# EAGLE design remote-switch (EAGLE 7.5.0)
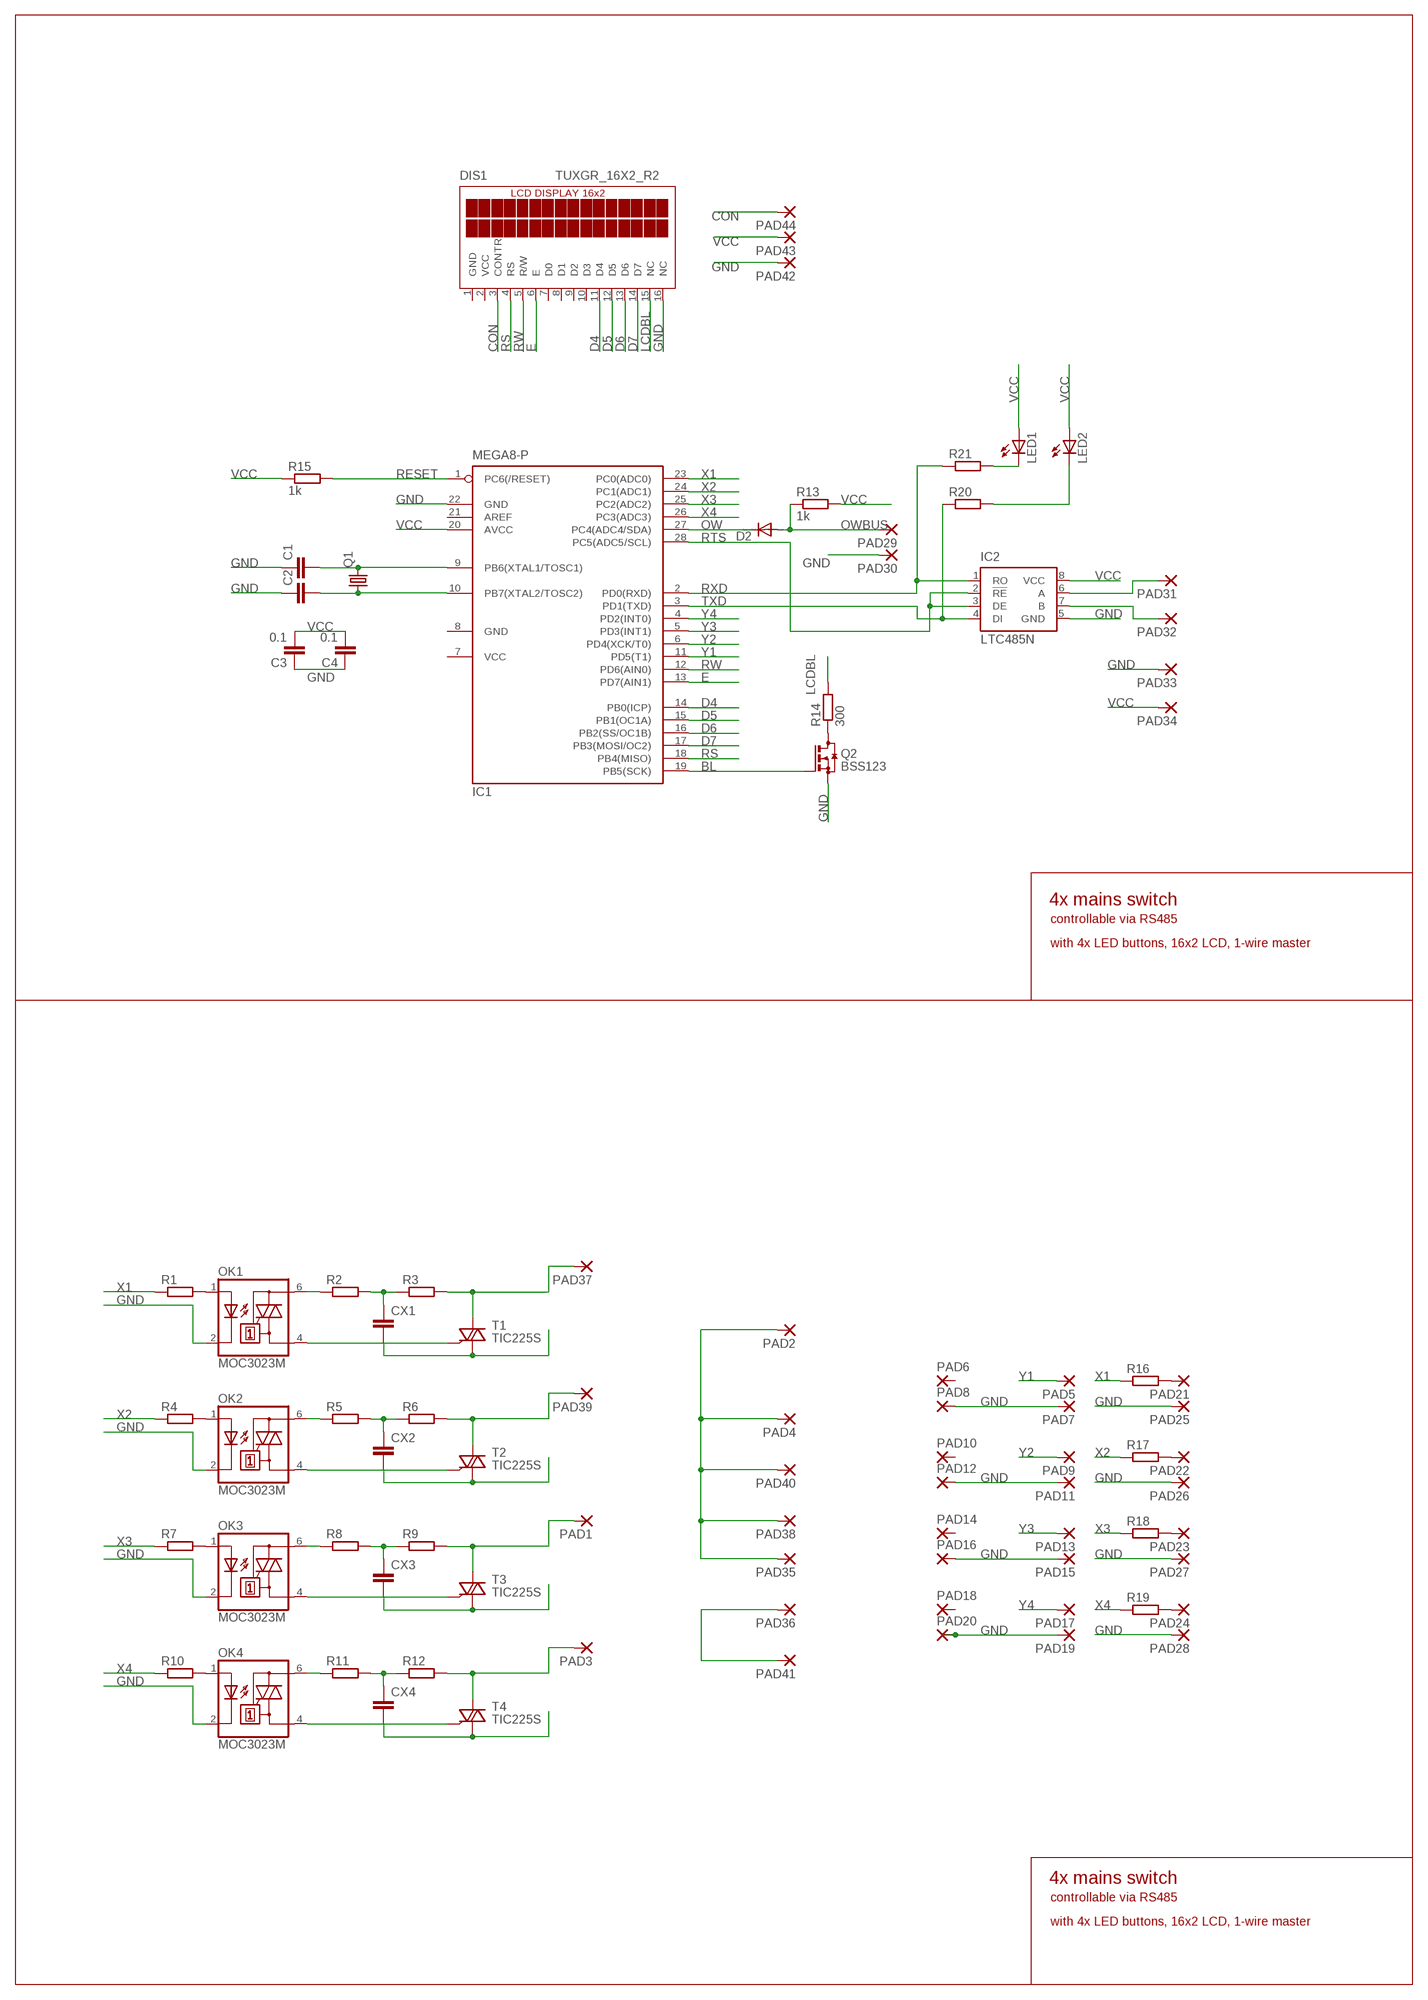
[diagram p0: schematic, sheet 1]

## Parts
C1  C-EUC0805  [C0805]
C2  C-EUC0805  [C0805]
C3  0.1  C-EUC0805  [C0805]
C4  0.1  C-EUC0805  [C0805]
CX1  CXXC15B5  [XC15B5]
CX2  CXXC15B5  [XC15B5]
CX3  CXXC15B5  [XC15B5]
CX4  CXXC15B5  [XC15B5]
D2  DIODE-MINIMELF  [MINIMELF]
DIS1  TUXGR_16X2_R2  [TUXGR_16X2_R2]
IC1  MEGA8-P  [DIL28-3]
IC2  LTC485N  [DIL08]
LED1  LEDSML0805  [SML0805]
LED2  LEDSML0805  [SML0805]
OK1  MOC3023M  [DIL06]
OK2  MOC3023M  [DIL06]
OK3  MOC3023M  [DIL06]
OK4  MOC3023M  [DIL06]
PAD1  2,54/0,8  [2,54/0,8]
PAD2  2,54/0,8  [2,54/0,8]
PAD3  2,54/0,8  [2,54/0,8]
PAD4  2,54/0,8  [2,54/0,8]
PAD5  1,6/0,8  [1,6/0,8]
PAD6  1,6/0,8  [1,6/0,8]
PAD7  1,6/0,8  [1,6/0,8]
PAD8  1,6/0,8  [1,6/0,8]
PAD9  1,6/0,8  [1,6/0,8]
PAD10  1,6/0,8  [1,6/0,8]
PAD11  1,6/0,8  [1,6/0,8]
PAD12  1,6/0,8  [1,6/0,8]
PAD13  1,6/0,8  [1,6/0,8]
PAD14  1,6/0,8  [1,6/0,8]
PAD15  1,6/0,8  [1,6/0,8]
PAD16  1,6/0,8  [1,6/0,8]
PAD17  1,6/0,8  [1,6/0,8]
PAD18  1,6/0,8  [1,6/0,8]
PAD19  1,6/0,8  [1,6/0,8]
PAD20  1,6/0,8  [1,6/0,8]
PAD21  1,6/0,8  [1,6/0,8]
PAD22  1,6/0,8  [1,6/0,8]
PAD23  1,6/0,8  [1,6/0,8]
PAD24  1,6/0,8  [1,6/0,8]
PAD25  1,6/0,8  [1,6/0,8]
PAD26  1,6/0,8  [1,6/0,8]
PAD27  1,6/0,8  [1,6/0,8]
PAD28  1,6/0,8  [1,6/0,8]
PAD29  2,54/0,8  [2,54/0,8]
PAD30  2,54/0,8  [2,54/0,8]
PAD31  2,54/0,8  [2,54/0,8]
PAD32  2,54/0,8  [2,54/0,8]
PAD33  2,54/0,8  [2,54/0,8]
PAD34  2,54/0,8  [2,54/0,8]
PAD35  2,54/0,8  [2,54/0,8]
PAD36  2,54/0,8  [2,54/0,8]
PAD37  2,54/0,8  [2,54/0,8]
PAD38  2,54/0,8  [2,54/0,8]
PAD39  2,54/0,8  [2,54/0,8]
PAD40  2,54/0,8  [2,54/0,8]
PAD41  2,54/0,8  [2,54/0,8]
PAD42  1,6/0,8  [1,6/0,8]
PAD43  1,6/0,8  [1,6/0,8]
PAD44  1,6/0,8  [1,6/0,8]
Q1  CRYSTALHC49S  [HC49/S]
Q2  BSS123  [SOT23]
R1  R-EU_M0805  [M0805]
R2  R-EU_R1206  [R1206]
R3  R-EU_R1206  [R1206]
R4  R-EU_M0805  [M0805]
R5  R-EU_R1206  [R1206]
R6  R-EU_R1206  [R1206]
R7  R-EU_M0805  [M0805]
R8  R-EU_R1206  [R1206]
R9  R-EU_R1206  [R1206]
R10  R-EU_M0805  [M0805]
R11  R-EU_R1206  [R1206]
R12  R-EU_R1206  [R1206]
R13  1k  R-EU_R0805  [R0805]
R14  300  R-EU_R0805  [R0805]
R15  1k  R-EU_R0805  [R0805]
R16  R-EU_M0805  [M0805]
R17  R-EU_M0805  [M0805]
R18  R-EU_M0805  [M0805]
R19  R-EU_M0805  [M0805]
R20  R-EU_M0805  [M0805]
R21  R-EU_M0805  [M0805]
T1  TIC225S  [TO220DS]
T2  TIC225S  [TO220DS]
T3  TIC225S  [TO220DS]
T4  TIC225S  [TO220DS]

## Nets
BL: IC1.19(PB5(SCK)) Q2.1(G)
CON: DIS1.3(CONTR) PAD44.1(P)
D4: DIS1.11(D4) IC1.14(PB0(ICP))
D5: DIS1.12(D5) IC1.15(PB1(OC1A))
D6: DIS1.13(D6) IC1.16(PB2(SS/OC1B))
D7: DIS1.14(D7) IC1.17(PB3(MOSI/OC2))
E: DIS1.6(E) IC1.13(PD7(AIN1))
GND: C1.1 C2.1 C3.1 C4.1 DIS1.16(NC) IC1.22(GND) IC2.5(GND) OK1.2(C) OK2.2(C) OK3.2(C) OK4.2(C) PAD7.1(P) PAD8.1(P) PAD11.1(P) PAD12.1(P) PAD15.1(P) PAD16.1(P) PAD19.1(P) PAD20.1(P) PAD25.1(P) PAD26.1(P) PAD27.1(P) PAD28.1(P) PAD30.1(P) PAD33.1(P) PAD42.1(P) Q2.2(S)
LCDBL: DIS1.15(NC) R14.2
N$1: OK1.1(A) R1.2
N$2: IC2.6(A) PAD31.1(P)
N$3: C1.2 IC1.9(PB6(XTAL1/TOSC1)) Q1.2
N$4: OK1.6(A2) R2.1
N$5: CX1.1 R2.2 R3.1
N$6: OK1.4(A1) T1.G
N$7: PAD37.1(P) R3.2 T1.A2
N$8: CX1.2 T1.A1
N$9: OK2.1(A) R4.2
N$10: C2.2 IC1.10(PB7(XTAL2/TOSC2)) Q1.1
N$11: Q2.3(D) R14.1
N$12: OK2.6(A2) R5.1
N$13: OK2.4(A1) T2.G
N$14: PAD39.1(P) R6.2 T2.A2
N$15: OK3.1(A) R7.2
N$16: CX2.1 R5.2 R6.1
N$17: CX2.2 T2.A1
N$18: IC2.7(B) PAD32.1(P)
N$19: PAD2.1(P) PAD4.1(P) PAD35.1(P) PAD38.1(P) PAD40.1(P)
N$20: OK3.6(A2) R8.1
N$21: OK3.4(A1) T3.G
N$22: PAD1.1(P) R9.2 T3.A2
N$23: CX3.1 R8.2 R9.1
N$24: CX3.2 T3.A1
N$25: OK4.1(A) R10.2
N$26: PAD36.1(P) PAD41.1(P)
N$27: PAD21.1(P) R16.2
N$28: OK4.6(A2) R11.1
N$29: OK4.4(A1) T4.G
N$30: PAD3.1(P) R12.2 T4.A2
N$31: CX4.1 R11.2 R12.1
N$32: CX4.2 T4.A1
N$33: PAD22.1(P) R17.2
N$34: PAD23.1(P) R18.2
N$35: PAD24.1(P) R19.2
N$36: LED1.C R21.2
N$37: LED2.C R20.2
OW: D2.C IC1.27(PC4(ADC4/SDA))
OWBUS: D2.A PAD29.1(P) R13.1
RESET: IC1.1(PC6(/RESET)) R15.2
RS: DIS1.4(RS) IC1.18(PB4(MISO))
RTS: IC1.28(PC5(ADC5/SCL)) IC2.2(!RE) IC2.3(DE)
RW: DIS1.5(R/W) IC1.12(PD6(AIN0))
RXD: IC1.2(PD0(RXD)) IC2.1(RO) R21.1
TXD: IC1.3(PD1(TXD)) IC2.4(DI) R20.1
VCC: C3.2 C4.2 IC1.20(AVCC) IC2.8(VCC) LED1.A LED2.A PAD34.1(P) PAD43.1(P) R13.2 R15.1
X1: IC1.23(PC0(ADC0)) R1.1 R16.1
X2: IC1.24(PC1(ADC1)) R4.1 R17.1
X3: IC1.25(PC2(ADC2)) R7.1 R18.1
X4: IC1.26(PC3(ADC3)) R10.1 R19.1
Y1: IC1.11(PD5(T1)) PAD5.1(P)
Y2: IC1.6(PD4(XCK/T0)) PAD9.1(P)
Y3: IC1.5(PD3(INT1)) PAD13.1(P)
Y4: IC1.4(PD2(INT0)) PAD17.1(P)
Unconnected: DIS1.7(D0) DIS1.8(D1) DIS1.9(D2) DIS1.10(D3) IC1.21(AREF) PAD6.1(P) PAD10.1(P) PAD14.1(P) PAD18.1(P)

## Notes on the sheet
- 4x mains switch
- controllable via RS485
- with 4x LED buttons, 16x2 LCD, 1-wire master
- 4x mains switch
- controllable via RS485
- with 4x LED buttons, 16x2 LCD, 1-wire master

## Power pins joined to a net without a drawn wire
GND: DIS1.1(GND) IC1.8(GND)
VCC: DIS1.2(VCC) IC1.7(VCC)

## Library data of the parts
C1-C4 = rcl:C-EU: CAPACITOR, European symbol
CX1-CX4 = resistor:CX: X CAPACITOR for power line
D2 = diode:DIODE-: DIODE
DIS1 = display-lcd:TUXGR_16X2_R2: Tuxgraphics LCD display 16x2 characters reflective, without background light Source: tuxgr_12x2_r2.pdf; OC_FARNELL: unknown; OC_NEWARK: unknown
IC1 = atmel:MEGA8-P: MICROCONTROLLER 8 Kbytes FLASH, 1 kbytes SRAM, 512 bytes EEPROM, USART, 4-channel 10 bit ADC, 2-channel 8 bit ADC Pin compatible with Atmega48, ATMega88, ATMega168 Source: avr.lbr; OC_FARNELL: unknown; OC_NEWARK: unknown
IC2 = linear-technology:LTC485: Low Power RS485 Interface Transceiver Source: http://www.linear.com/pc/downloadDocument.do?navId=H0,C1,C1007,C1017,P2064,D1718; OC_FARNELL: unknown; OC_NEWARK: unknown
LED1 LED2 = led:LED: LED OSRAM: - CHIPLED LG R971, LG N971, LY N971, LG Q971, LY Q971, LO R971, LY R971 LH N974, LH R974 LS Q976, LO Q976, LY Q976 LO Q996 - Hyper CHIPLED LW Q18S LB Q993, LB Q99A, LB R99A - SideLED LS A670, LO A670, LY A670, LG A670, LP A670 LB A673, LV A673, LT A673, LW A673 LH A674 LY A675 LS A676, LA A676, LO A676, LY A676, LW A676 LS A679, LY A679, LG A679 - Hyper Micro SIDELED® LS Y876, LA Y876, LO Y876, LY Y876 LT Y87S - SmartLED LW L88C, LW L88S LB L89C, LB L89S, LG L890 LS L89K, LO L89K, LY L89K LS L896, LA L896, LO L896, LY L896 - TOPLED LS T670, LO T670, LY T670, LG T670, LP T670 LSG T670, LSP T670, LSY T670, LOP T670, LYG T670 LG T671, LOG T671, LSG T671 LB T673, LV T673, LT T673, LW T673 LH T674 LS T676, LA T676, LO T676, LY T676, LB T676, LH T676, LSB T676, LW T676 LB T67C, LV T67C, LT T67C, LS T67K, LO T67K, LY T67K, LW E67C LS E67B, LA E67B, LO E67B, LY E67B, LB E67C, LV E67C, LT E67C LW T67C LS T679, LY T679, LG T679 LS T770, LO T770, LY T770, LG T770, LP T770 LB T773, LV T773, LT T773, LW T773 LH T774 LS E675, LA E675, LY E675, LS T675 LS T776, LA T776, LO T776, LY T776, LB T776 LHGB T686 LT T68C, LB T68C - Hyper Mini TOPLED® LB M676 - Mini TOPLED Santana® LG M470 LS M47K, LO M47K, LY M47K Source: http://www.osram.convergy.de LUXEON: - LUMILED® LXK2-PW12-R00, LXK2-PW12-S00, LXK2-PW14-U00, LXK2-PW14-V00 LXK2-PM12-R00, LXK2-PM12-S00, LXK2-PM14-U00 LXK2-PE12-Q00, LXK2-PE12-R00, LXK2-PE12-S00, LXK2-PE14-T00, LXK2-PE14-U00 LXK2-PB12-K00, LXK2-PB12-L00, LXK2-PB12-M00, LXK2-PB14-N00, LXK2-PB14-P00, LXK2-PB14-Q00 LXK2-PR12-L00, LXK2-PR12-M00, LXK2-PR14-Q00, LXK2-PR14-R00 LXK2-PD12-Q00, LXK2-PD12-R00, LXK2-PD12-S00 LXK2-PH12-R00, LXK2-PH12-S00 LXK2-PL12-P00, LXK2-PL12-Q00, LXK2-PL12-R00 Source: www.luxeon.com KINGBRIGHT: KA-3528ASYC Source: www.kingbright.com
OK1-OK4 = optocoupler:MOC30*M: RANDOM-PHASE OPTOISOLATORS TRIAC DRIVER OUTPUT Source: http://www.fairchildsemi.com MOC3020-M.pdf; MF: FAIRCHILD SEMICONDUCTOR; MPN: MOC3023-M; OC_FARNELL: 1021367; OC_NEWARK: 72K8896
PAD1-PAD4 PAD29-PAD41 = wirepad:2,54/0,8: THROUGH-HOLE PAD
PAD5-PAD28 PAD42-PAD44 = wirepad:1,6/0,8: THROUGH-HOLE PAD
Q1 = crystal:CRYSTAL: CRYSTAL; OC_FARNELL: 1667008; OC_NEWARK: unknown
Q2 = transistor-small-signal:BSS123: N-CHANNEL MOS FET
R1-R21 = rcl:R-EU_: RESISTOR, European symbol
T1-T4 = triac:TIC225S: TRIAC

## Board
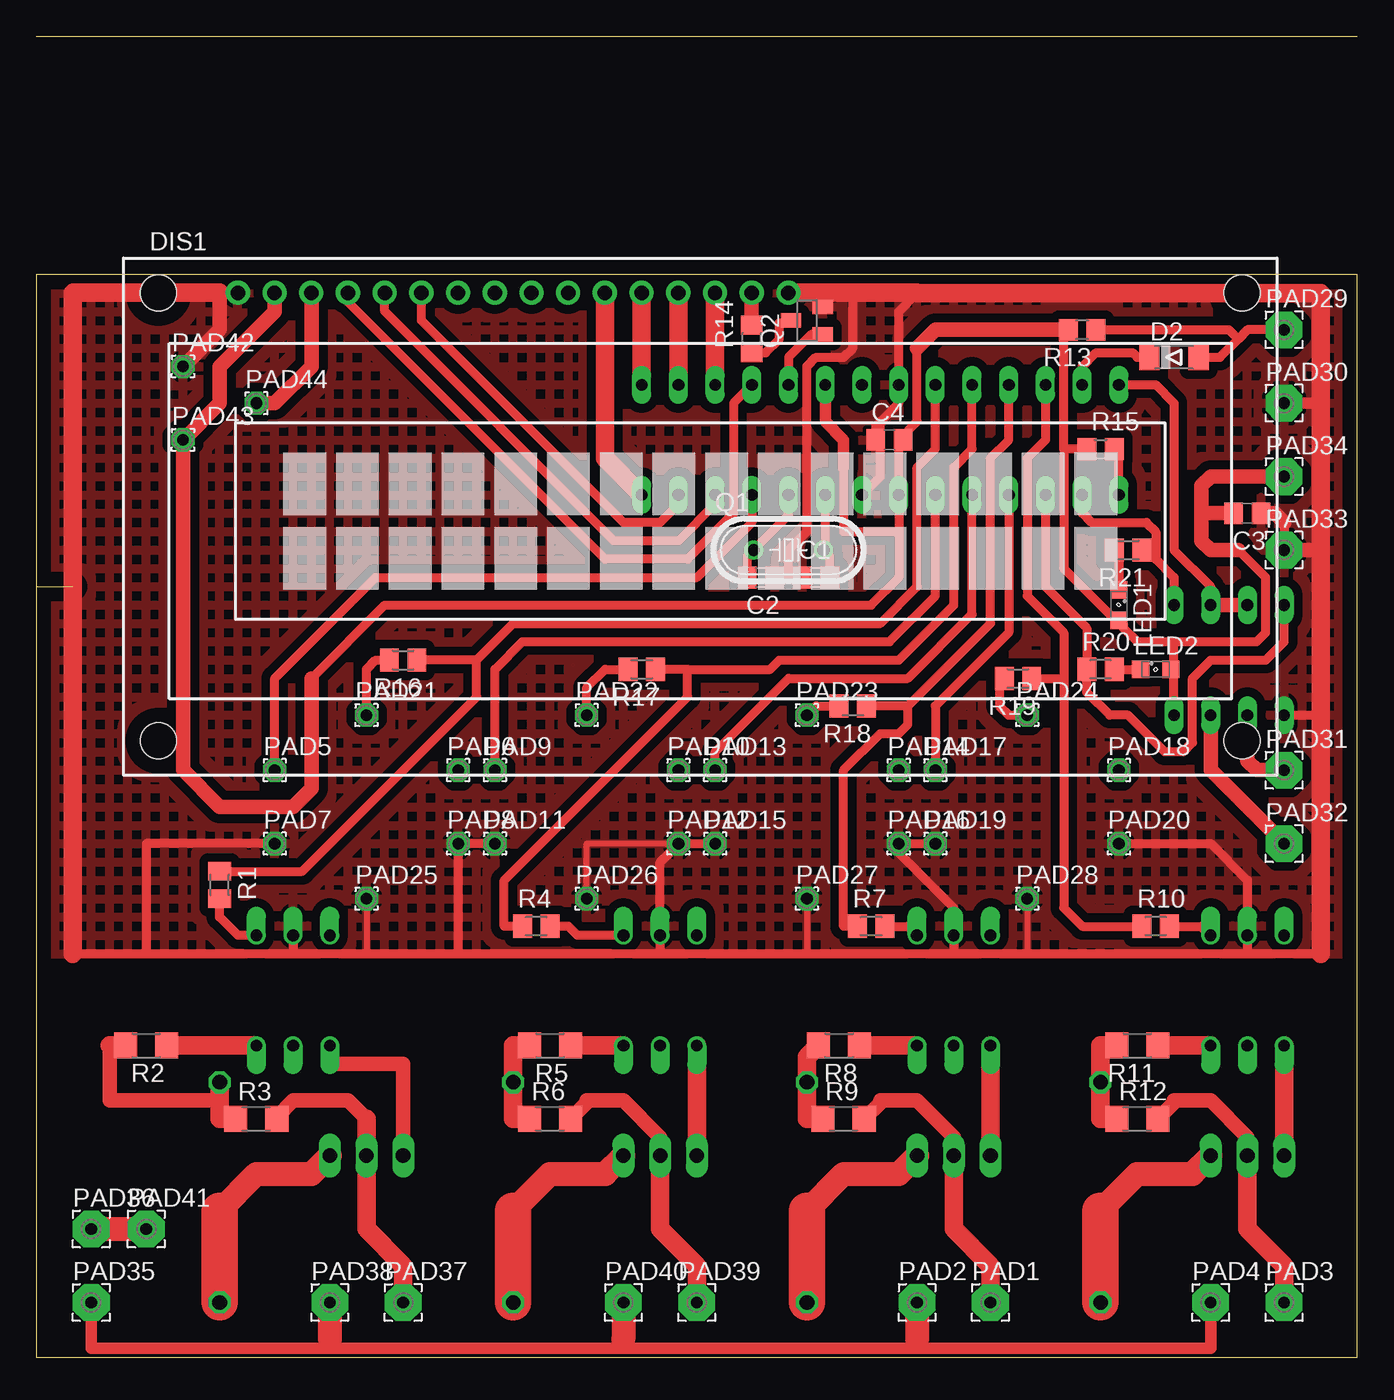
[diagram p1: board, top side]
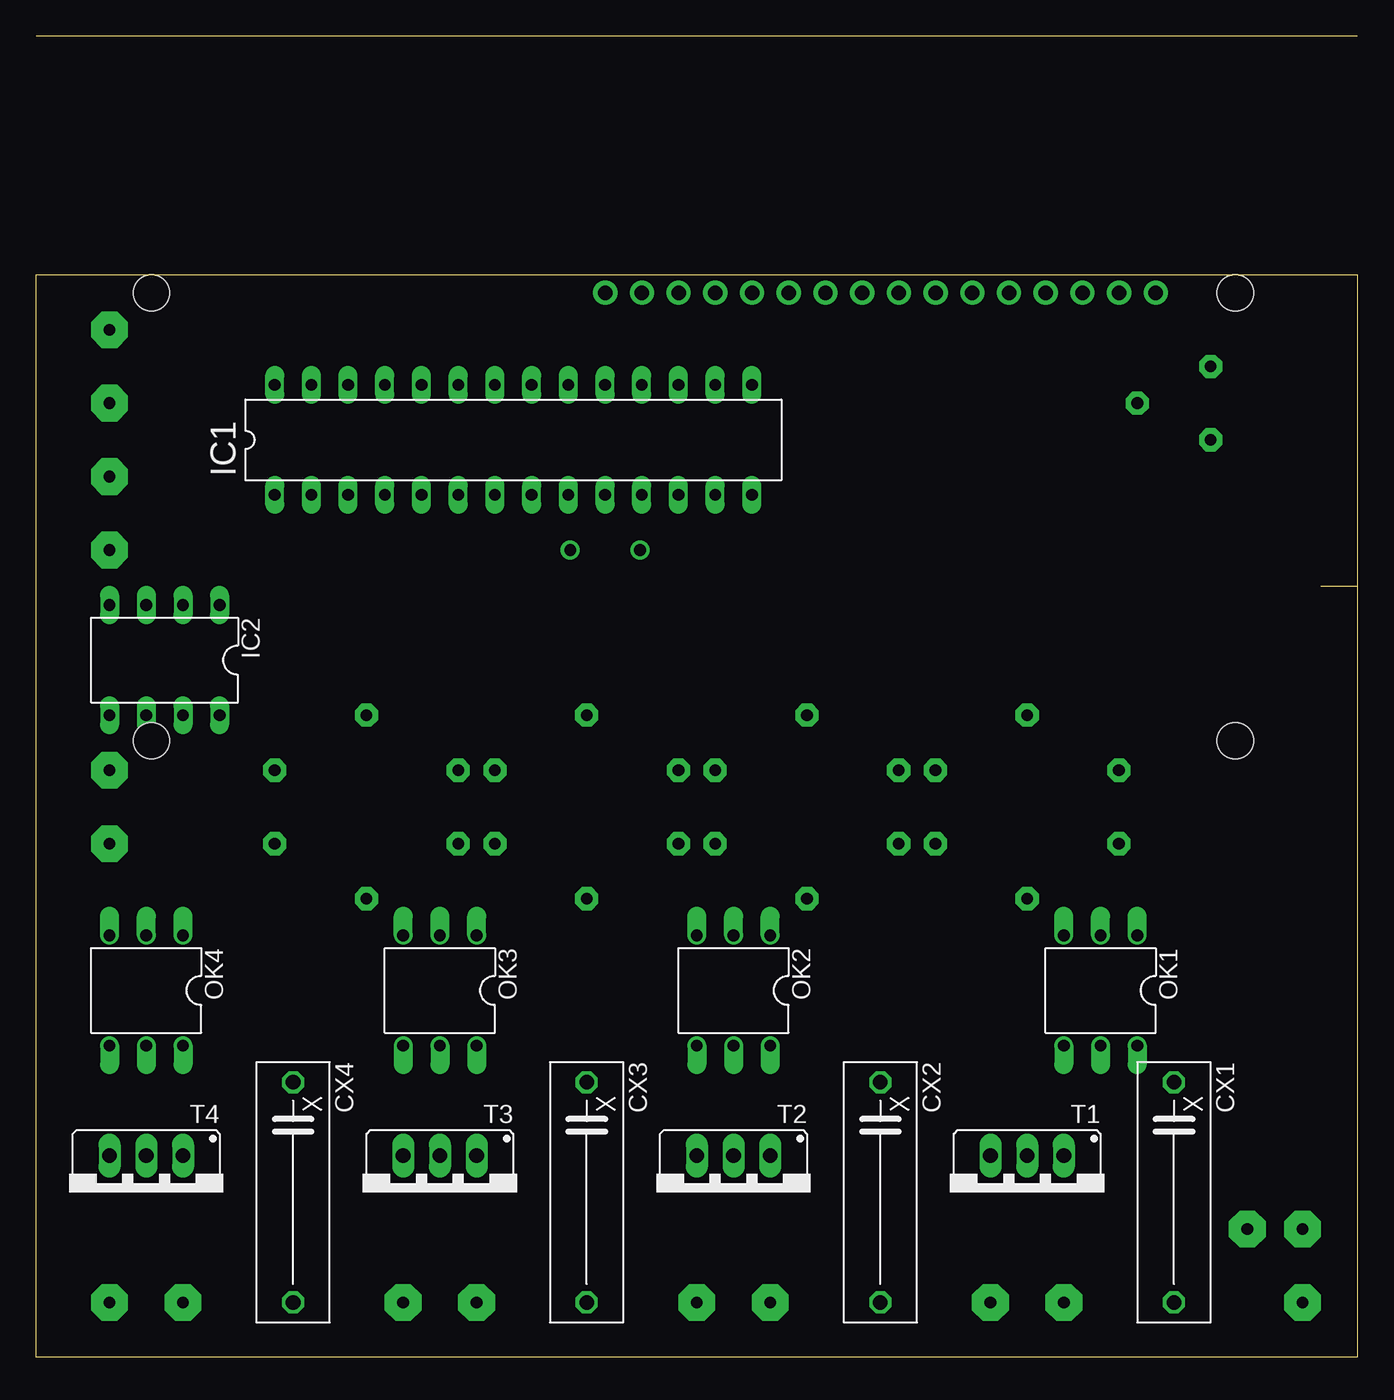
[diagram p2: board, bottom side, seen from below]

Size 91.44 x 91.44 mm. Coordinates in mm from the lower left corner, seen from the top.
Outline: 0,53.34 0,74.93 91.44,74.93 91.44,0 0,0 0,53.34
Outline: 0,91.44 91.44,91.44
Outline: 0,53.34 2.54,53.34
Copper layers (1*16): Top 0.035mm / dielectric 1.5mm / Bottom 0.035mm
Design rules "default": minimum track width 10mil, minimum drill 24mil, track to track 8mil, track to pad 8mil, pad to pad 8mil, via to via 8mil, smd to smd 8mil, copper to edge 40mil, drill to drill 8mil, minimum pad ring 10mil, minimum via ring 8mil, stop-mask expansion 4mil, vias tented up to drill 0mil, thermal gap 10mil

### Footprints (pad centres in the part's own frame; a part is rotated, then mirrored left to right if it is on the bottom)
C0805 = smd 1.3 x 1.5: 1 -0.95,0; 2 0.95,0
XC15B5 = drill 1.016 octagon: 1 -7.62,0; 2 7.62,0
MINIMELF = smd 1.4 x 1.8: A 1.7,0; C -1.7,0
TUXGR_16X2_R2 = drill 1 pad 1.676: 1 -32,15.5; 2 -29.46,15.5; 3 -26.92,15.5; 4 -24.38,15.5; 5 -21.84,15.5; 6 -19.3,15.5; 7 -16.76,15.5; 8 -14.22,15.5; 9 -11.68,15.5; 10 -9.14,15.5; 11 -6.6,15.5; 12 -4.06,15.5; 13 -1.52,15.5; 14 1.02,15.5; 15 3.56,15.5; 16 6.1,15.5 | hole 2.5: -37.5,-15.5; 37.5,-15.5; -37.5,15.5; 37.5,15.5
DIL28-3 = drill 0.813 long: 1 -16.51,-3.81; 2 -13.97,-3.81; 3 -11.43,-3.81; 4 -8.89,-3.81; 5 -6.35,-3.81; 6 -3.81,-3.81; 7 -1.27,-3.81; 8 1.27,-3.81; 9 3.81,-3.81; 10 6.35,-3.81; 11 8.89,-3.81; 12 11.43,-3.81; 13 13.97,-3.81; 14 16.51,-3.81; 15 16.51,3.81; 16 13.97,3.81; 17 11.43,3.81; 18 8.89,3.81; 19 6.35,3.81; 20 3.81,3.81; 21 1.27,3.81; 22 -1.27,3.81; 23 -3.81,3.81; 24 -6.35,3.81; 25 -8.89,3.81; 26 -11.43,3.81; 27 -13.97,3.81; 28 -16.51,3.81
DIL08 = drill 0.813 long: 1 -3.81,-3.81; 2 -1.27,-3.81; 3 1.27,-3.81; 4 3.81,-3.81; 5 3.81,3.81; 6 1.27,3.81; 7 -1.27,3.81; 8 -3.81,3.81
SML0805 = smd 1.2 x 1.2: A 1.05,0; C -1.05,0
DIL06 = drill 0.813 offset: 1 -2.54,-3.81; 2 0,-3.81; 3 2.54,-3.81; 4 2.54,3.81; 5 0,3.81; 6 -2.54,3.81
2,54/0,8 = drill 0.813 pad 2.54 octagon: 1 0,0
1,6/0,8 = drill 0.813 pad 1.6 octagon: 1 0,0
HC49/S = drill 0.813: 1 -2.413,0; 2 2.413,0
SOT23 = smd 1 x 1.4: 1 -0.95,-1.1; 2 0.95,-1.1; 3 0,1.1
M0805 = smd 1.3 x 1.6: 1 -0.95,0; 2 0.95,0
R1206 = smd 1.6 x 1.803: 1 -1.422,0; 2 1.422,0
R0805 = smd 1.3 x 1.5: 1 -0.95,0; 2 0.95,0
TO220DS = drill 1.016 long: A1 -2.54,-2.54; A2 0,-2.54; G 2.54,-2.54

### Placement (x,y rotation side)
C1  53.98,53.98 0 top
C2  50.16,53.98 180 top
C3  83.82,58.42 180 top
C4  59.05,63.5 0 top
CX1  12.7,11.43 270 bottom
CX2  33.02,11.43 270 bottom
CX3  53.34,11.43 270 bottom
CX4  73.66,11.43 270 bottom
D2  78.74,69.22 0 top
DIS1  45.96,58.18 0 top
IC1  58.42,63.5 0 bottom
IC2  82.55,48.26 180 bottom
LED1  74.93,52.07 270 top
LED2  77.47,47.62 0 top
OK1  17.78,25.4 180 bottom
OK2  43.18,25.4 180 bottom
OK3  63.5,25.4 180 bottom
OK4  83.82,25.4 180 bottom
PAD1  66.04,3.81 0 top
PAD2  60.96,3.81 0 top
PAD3  86.36,3.81 0 top
PAD4  81.28,3.81 0 top
PAD5  16.51,40.64 0 top
PAD6  29.21,40.64 0 top
PAD7  16.51,35.56 0 top
PAD8  29.21,35.56 0 top
PAD9  31.75,40.64 0 top
PAD10  44.45,40.64 0 top
PAD11  31.75,35.56 0 top
PAD12  44.45,35.56 0 top
PAD13  46.99,40.64 0 top
PAD14  59.69,40.64 0 top
PAD15  46.99,35.56 0 top
PAD16  59.69,35.56 0 top
PAD17  62.23,40.64 0 top
PAD18  74.93,40.64 0 top
PAD19  62.23,35.56 0 top
PAD20  74.93,35.56 0 top
PAD21  22.86,44.45 0 top
PAD22  38.1,44.45 0 top
PAD23  53.34,44.45 0 top
PAD24  68.58,44.45 0 top
PAD25  22.86,31.75 0 top
PAD26  38.1,31.75 0 top
PAD27  53.34,31.75 0 top
PAD28  68.58,31.75 0 top
PAD29  86.36,71.12 0 top
PAD30  86.36,66.04 0 top
PAD31  86.36,40.64 0 top
PAD32  86.36,35.56 0 top
PAD33  86.36,55.88 0 top
PAD34  86.36,60.96 0 top
PAD35  3.81,3.81 0 top
PAD36  3.81,8.89 0 top
PAD37  25.4,3.81 0 top
PAD38  20.32,3.81 0 top
PAD39  45.72,3.81 0 top
PAD40  40.64,3.81 0 top
PAD41  7.62,8.89 0 top
PAD42  10.16,68.58 0 top
PAD43  10.16,63.5 0 top
PAD44  15.24,66.04 0 top
Q1  52.07,55.88 0 top
Q2  53.34,71.75 90 top
R1  12.7,32.7 270 top
R2  7.62,21.59 180 top
R3  15.24,16.51 0 top
R4  34.61,29.84 0 top
R5  35.56,21.59 180 top
R6  35.56,16.51 0 top
R7  57.78,29.84 0 top
R8  55.56,21.59 180 top
R9  55.88,16.51 0 top
R10  77.47,29.84 0 top
R11  76.2,21.59 180 top
R12  76.2,16.51 0 top
R13  72.39,71.12 180 top
R14  49.53,70.48 90 top
R15  73.66,62.87 0 top
R16  25.4,48.26 180 top
R17  41.91,47.62 180 top
R18  56.52,45.09 180 top
R19  67.94,46.99 180 top
R20  73.66,47.62 0 top
R21  75.56,55.88 180 top
T1  22.86,11.43 180 bottom
T2  43.18,11.43 180 bottom
T3  63.5,11.43 180 bottom
T4  83.82,11.43 180 bottom

### Tracks (layer width: path | path; a pad name or v marks a point on that pad's centre or on a via)
BL
  Top 0.61: Q2.1 53.66,70.81 52.07,69.22 IC1.19
CON
  Top 1.016: PAD44.1 16.51,66.04 19.05,68.58 DIS1.3
D4
  Top 1.27: IC1.14 39.36,62.24 DIS1.11
D5
  Top 1.27: IC1.15 41.9,67.31 DIS1.12
D6
  Top 1.27: IC1.16 44.44,67.31 DIS1.13
D7
  Top 1.27: IC1.17 46.98,67.31 DIS1.14
E
  Top 0.61: IC1.13 44.45,59.05 43.18,57.78 40.64,57.78 26.66,71.77 DIS1.6
GND
  Top 0.406: PAD25.1 22.86,27.94 | PAD26.1 38.1,35.56 43.81,35.56 43.81,34.92 | PAD27.1 53.34,27.94 | PAD28.1 68.58,27.94
  Top 0.61: OK1.2 17.78,27.94 | 17.78,27.94 7.62,27.94 | 7.62,27.94 2.54,27.94 | 2.54,73.66 2.56,73.68 | 12.7,73.68 DIS1.1 | 43.18,27.94 OK2.2 43.18,34.29 43.81,34.92 PAD12.1 PAD15.1 | 43.18,27.94 29.21,27.94 | 29.21,27.94 22.86,27.94 17.78,27.94 | 63.5,27.94 OK3.2 63.5,31.11 59.69,34.92 PAD16.1 PAD19.1 | 63.5,27.94 53.34,27.94 43.18,27.94 | 88.9,27.94 83.82,27.94 | 83.82,27.94 68.58,27.94 63.5,27.94 | 58.42,64.77 58.42,60.96 IC1.8 | 58.42,64.77 59.69,66.04 IC1.22 59.69,72.39 60.96,73.66 60.94,73.68 | DIS1.16 53.95,73.68 54.61,73.66 54.61,72.88 Q2.2 | C2.1 52.07,53.98 | 52.07,53.98 52.07,55.88 53.34,57.15 53.34,68.58 53.98,69.22 55.88,69.22 56.52,69.85 56.52,73.68 | C1.1 52.07,53.98 | 83.82,27.94 OK4.2 83.82,33.02 81.28,35.56 PAD20.1 | IC2.5 88.9,44.45 | 86.36,57.78 PAD33.1 | C4.1 58.1,64.45 58.42,64.77 | 29.21,27.94 PAD8.1 PAD11.1 | PAD7.1 7.62,35.56 7.62,27.94
  Top 0.813: PAD30.1 88.9,66.04
  Top 1.016: PAD33.1 88.9,55.88 | C3.1 85.72,58.42 86.36,57.78 | PAD42.1 12.7,71.12 12.7,73.68
  Top 1.27: 2.54,27.94 2.54,73.66 | 2.56,73.68 12.7,73.68 | 88.9,27.94 88.9,44.45 88.9,55.88 88.9,66.04 88.9,73.66 60.96,73.66 | DIS1.16 56.52,73.68 60.94,73.68
  pour Top (isolate 0.61, hatched): 0,27.94 91.44,27.94 91.44,74.93 0,74.93
LCDBL
  Top 0.61: 49.52,72.08 R14.2
  Top 1.016: DIS1.15 49.52,72.08
N$1
  Top 0.61: OK1.1 13.97,29.21 12.7,30.48 R1.2
N$2
  Top 1.016: IC2.6 83.82,41.27 84.45,40.64 PAD31.1
N$3
  Top 0.61: IC1.9 54.61,56.01 Q1.2 54.92,55.44 C1.2
N$4
  Top 1.27: R2.1 OK1.6
N$5
  Top 1.016: 5.08,21.59 5.08,17.78 12.7,17.78
  Top 1.27: 5.08,21.59 R2.2 | R3.1 12.7,16.51 12.7,17.78 CX1.1
N$6
  Top 1.016: OK1.4 20.32,20.32 25.4,20.32 T1.G
N$7
  Top 1.016: R3.2 16.66,16.66 17.78,17.78 21.59,17.78 22.86,16.51
  Top 1.27: 22.86,16.51 T1.A2 22.86,8.89 25.4,6.35 PAD37.1
N$8
  Top 1.676: 12.7,10.16 15.24,12.7 19.05,12.7 T1.A1
  Top 2.54: CX1.2 12.7,10.16
N$9
  Top 0.61: OK2.1 37.46,29.21 36.83,29.84 R4.2
N$10
  Top 0.61: IC1.10 52.07,58.29 Q1.1 49.22,55.44 C2.2
N$11
  Top 0.61: R14.1 50.48,69.53 51.44,70.48 51.44,71.58 Q2.3
N$12
  Top 1.27: R5.1 OK2.6
N$13
  Top 1.27: OK2.4 T2.G
N$14
  Top 1.016: T2.A2 43.18,15.24 40.64,17.78 38.1,17.78 38.1,17.63 R6.2
  Top 1.27: T2.A2 43.18,8.89 45.72,6.35 PAD39.1
N$15
  Top 0.61: R7.2 60.33,29.84 OK3.1
N$16
  Top 1.27: R5.2 33.02,21.59 CX2.1 33.02,16.51 R6.1
N$17
  Top 1.676: 33.02,10.16 35.56,12.7 39.37,12.7 T2.A1
  Top 2.54: CX2.2 33.02,10.16
N$18
  Top 1.016: IC2.7 81.28,40.64 PAD32.1
N$19
  Top 0.813: PAD35.1 3.81,0.64 20.32,0.64 | 20.32,0.64 40.64,0.64 | 40.64,0.64 60.96,0.64 | 60.96,0.64 81.28,0.64 PAD4.1 | 60.96,0.64 60.96,1.27 | PAD40.1 40.64,0.64 | PAD38.1 20.32,0.64
  Top 1.676: PAD38.1 20.32,1.27 | PAD40.1 40.64,1.27 | PAD2.1 60.96,1.27
N$20
  Top 1.27: R8.1 OK3.6
N$21
  Top 1.27: T3.G OK3.4
N$22
  Top 1.016: T3.A2 63.5,15.24 60.96,17.78 58.42,17.78 58.42,17.63 R9.2
  Top 1.27: T3.A2 63.5,8.89 66.04,6.35 PAD1.1
N$23
  Top 1.27: R9.1 53.34,16.51 CX3.1 53.34,20.79 R8.2
N$24
  Top 1.676: 53.34,10.16 55.88,12.7 59.69,12.7 T3.A1
  Top 2.54: CX3.2 53.34,10.16
N$25
  Top 0.61: R10.2 80.64,29.84 OK4.1
N$26
  Top 1.676: PAD36.1 PAD41.1
N$27
  Top 0.61: PAD21.1 22.86,47.62 23.5,48.26 R16.2
N$28
  Top 1.27: R11.1 OK4.6
N$29
  Top 1.27: T4.G OK4.4
N$30
  Top 1.016: T4.A2 83.82,15.24 81.28,17.78 78.74,17.78 78.74,17.63 R12.2
  Top 1.27: T4.A2 83.82,8.89 86.36,6.35 PAD3.1
N$31
  Top 1.27: R12.1 73.66,16.51 CX4.1 73.66,21.59 R11.2
N$32
  Top 1.676: 73.66,10.16 76.2,12.7 80.01,12.7 T4.A1
  Top 2.54: CX4.2 73.66,10.16
N$33
  Top 0.61: PAD22.1 38.1,46.35 39.37,47.62 R17.2
N$34
  Top 0.61: PAD23.1 53.98,45.09 R18.2
N$35
  Top 0.61: R19.2 66.67,46.67 66.67,45.09 67.31,44.45 PAD24.1
N$36
  Top 0.61: R21.2 74.93,55.56 LED1.C
N$37
  Top 0.61: R20.2 LED2.C
OW
  Top 0.61: IC1.27 72.39,68.58 73.34,69.53 75.89,69.53 76.2,69.22 D2.C
OWBUS
  Top 0.61: R13.1 82.55,71.12 83.19,70.48 | D2.A 81.92,69.22 83.19,70.48 | PAD29.1 83.82,71.12 83.19,70.48
RESET
  Top 0.61: IC1.1 74.93,62.55 R15.2
RS
  Top 0.61: IC1.18 48.26,66.04 48.26,58.42 45.09,55.24 39.37,55.24 21.58,73.04 DIS1.4
RTS
  Top 0.61: IC1.28 77.47,67.31 78.74,66.04 78.74,55.88 81.28,53.34 IC2.2
  Top 1.016: IC2.3 IC2.2
RW
  Top 0.61: IC1.12 46.99,59.05 44.45,56.52 40.01,56.52 24.12,72.4 DIS1.5
RXD
  Top 0.61: IC1.2 72.39,58.42 73.03,57.78 76.83,57.78 77.47,57.15 77.47,55.88 | 77.47,55.88 77.47,55.24 78.74,53.98 IC2.1 | R21.1 77.47,55.88
TXD
  Top 0.61: IC2.4 86.36,49.53 85.09,48.26 81.28,48.26 80.01,46.99 80.01,42.55 79.38,41.91 78.11,41.91 75.56,44.45 74.3,44.45 72.71,46.03 R20.1 72.71,50.48 69.85,53.34 IC1.3
VCC
  Top 0.61: 59.69,57.15 IC1.7 59.69,63.5 | 59.69,57.15 59.69,53.98 57.78,52.07 24.13,52.07 19.05,46.99 | 55.88,61.59 55.88,57.15 59.69,57.15 | 59.69,63.5 60.96,64.77 60.96,69.85 | R13.2 71.12,71.12 71.12,62.87 | R15.1 71.12,62.87 | 71.12,62.87 71.12,54.61 75.25,50.48 | 75.25,50.48 76.2,49.53 78.74,49.53 | IC2.8 78.74,47.84 | 78.74,47.84 78.74,49.53 | 78.74,49.53 84.45,49.53 85.09,50.16 85.09,53.98 83.19,55.88 | C4.2 59.69,63.5 | LED2.A 78.74,47.84 | LED1.A 75.25,50.7 75.25,50.48
  Top 0.813: IC1.20 54.61,64.77 55.88,63.5 55.88,61.59
  Top 1.016: 60.96,69.85 62.23,71.12 71.12,71.12 | C3.2 80.64,58.42 | 19.05,46.99 19.05,39.37 17.78,38.1 12.7,38.1 10.16,40.64 PAD43.1 12.7,66.04 12.7,68.58 16.51,72.39 DIS1.2 | 80.64,58.42 80.64,60.33 81.28,60.96 PAD34.1 | 80.64,58.42 80.64,56.52 81.28,55.88 83.19,55.88
X1
  Top 0.61: IC1.23 62.23,62.87 60.96,61.59 60.96,53.34 58.42,50.8 33.02,50.8 30.48,48.26 | R1.1 18.41,33.65 30.48,45.72 30.48,48.26 | 30.48,48.26 R16.1
X2
  Top 0.61: IC1.24 64.77,62.87 63.5,61.59 63.5,52.07 59.69,48.26 51.44,48.26 50.8,47.62 45.09,47.62 | R4.1 32.38,29.84 32.38,33.02 45.09,45.72 45.09,47.62 | 45.09,47.62 R17.1
X3
  Top 0.61: IC1.25 67.31,63.5 66.04,62.23 66.04,50.8 60.33,45.09 | R7.1 55.88,29.84 55.88,40.64 58.42,43.18 59.69,43.18 60.33,43.81 60.33,45.09 | 60.33,45.09 R18.1
X4
  Top 0.61: IC1.26 69.85,63.5 68.58,62.23 68.58,52.7 71.12,50.16 71.12,46.99 | 71.12,46.99 71.12,31.11 72.39,29.84 R10.1 | R19.1 71.12,46.99
Y1
  Top 0.61: IC1.11 49.53,57.78 45.72,53.98 23.5,53.98 16.51,46.99 PAD5.1
Y2
  Top 0.61: IC1.6 62.23,52.7 59.05,49.53 33.66,49.53 31.75,47.62 PAD9.1
Y3
  Top 0.61: PAD13.1 46.99,41.91 52.07,46.99 60.33,46.99 64.77,51.44 IC1.5
Y4
  Top 0.61: IC1.4 67.31,50.16 62.23,45.09 PAD17.1